# Altium schematic sheet TP1_NodoWiFi_Per_Rev0.SchDoc: TP1 NodoWifi Per Rev0
size A4; Author: Alejandro Darío Sobral; SheetNumber: 2; SheetTotal: 5
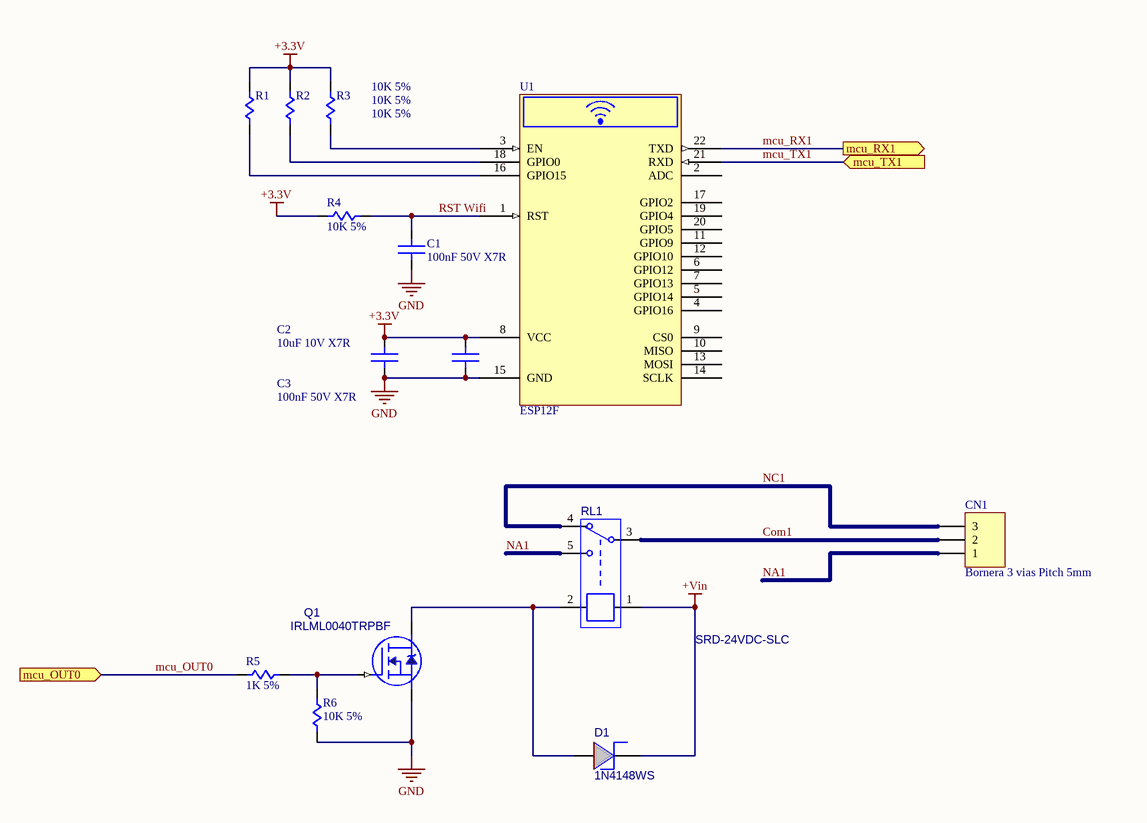
[diagram p0: TP1_NodoWiFi_Per_Rev0.SchDoc]

## Parts
C1  100nF 50V X7R  [C_0805]
C2  10uF 10V X7R  [C_0805]
C3  100nF 50V X7R  [C_0805]
CN1  Bornera 3 vias Pitch 5mm  [TerminalBlock_1x3_P5mm]
D1  1N4148WS  [D_0805]
Q1  IRLML0040TRPBF  [SOT_23]
R1  10K 5%  [R_0805]
R2  10K 5%  [R_0805]
R3  10K 5%  [R_0805]
R4  10K 5%  [R_0805]
R5  1K 5%  [R_0805]
R6  10K 5%  [R_0805]
RL1  SRD-24VDC-SLC  [943-1C]
U1  ESP12F  [ESP12F]

## Ports
mcu_OUT0 (in, see TP1_NodoWiFi_blk_Rev0[3B], TP1_NodoWiFi_Cpu1_Rev0[3B]), mcu_RX1 (out, see TP1_NodoWiFi_blk_Rev0[3B], TP1_NodoWiFi_Cpu1_Rev0[3B]), mcu_TX1 (in, see TP1_NodoWiFi_blk_Rev0[3B], TP1_NodoWiFi_Cpu1_Rev0[3B])

## Nets
+3.3V: C2.2(Cap) C3.2(Cap) R1.2(Cap) R2.2(Cap) R3.2(Cap) R4.2(Cap) U1.8(VCC)
+Vin: D1.2(K) RL1.1
GND: C1.1(Cap) C2.1(Cap) C3.1(Cap) Q1.2(SOURCE) R6.1(Cap) U1.15(GND)
Com1: CN1.2 RL1.3
mcu_OUT0: R5.2(Cap) ; port mcu_OUT0
mcu_RX1: U1.22(TXD) ; port mcu_RX1
mcu_TX1: U1.21(RXD) ; port mcu_TX1
NA1: CN1.1 RL1.5
NC1: CN1.3 RL1.4
RST Wifi: C1.2(Cap) R4.1(Cap) U1.1(RST)
NetD1_1: D1.1(A) Q1.3(DRAIN) RL1.2
NetQ1_1: Q1.1(GATE) R5.1(Cap) R6.2(Cap)
NetR1_1: R1.1(Cap) U1.16(GPIO15)
NetR2_1: R2.1(Cap) U1.18(GPIO0)
NetR3_1: R3.1(Cap) U1.3(EN)

Not connected (* = marked no-connect by the designer): U1 2(ADC) 4(GPIO16) 5(GPIO14) 6(GPIO12) 7(GPIO13) 9(CS0) 10(MISO) 11(GPIO9) 12(GPIO10) 13(MOSI) 14(SCLK) 17(GPIO2) 19(GPIO4) 20(GPIO5)

## Notes on the sheet
- Title:
- Size:
- Author:
- A4
- Sheet
- of
- Revision:
- File:
- Date:

## Library data of the parts
C1-C3 = Capacitor_NoP: capacitor no polarizado
CN1 = CONN_03P: Connector Generic 3 Vias
D1 = DIODO_SH: Diode Shottky
Q1 = N_MOSFET_SOT23: Mosfet N-Ch
R1-R6 = Resistencia: Resistor
RL1 = RELAY SPDT
U1 = ESP12F Wifi Module: Wifi Module